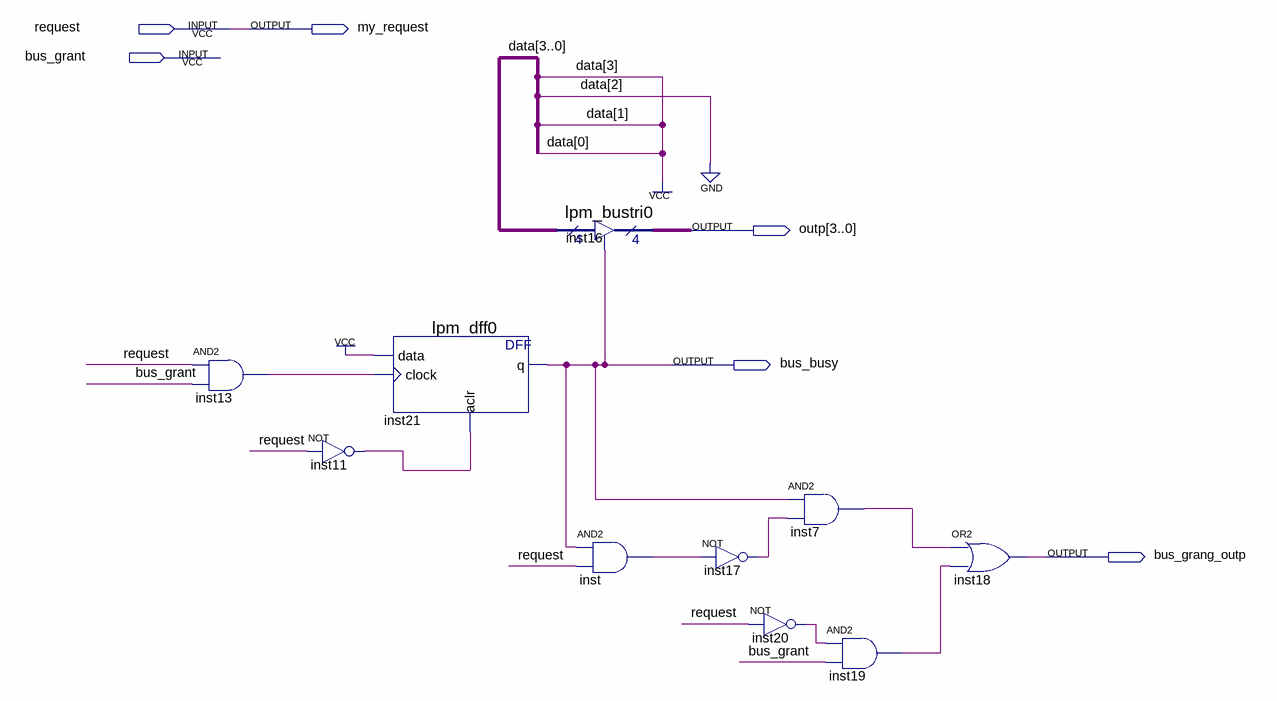
[diagram p0: schematic sheet]
// Quartus schematic device2.bdf as structural Verilog: 10 symbols, 6 pins
module device2 (
  input  request,
  input  bus_grant,
  output my_request,
  output [3:0] outp,
  output bus_busy,
  output bus_grang_outp
);

  wire inst7_out, inst11_out, inst13_out, inst17_out, inst19_out, inst20_out, inst_out;

  and inst13 (inst13_out, request, bus_grant);
  not inst11 (inst11_out, request);
  lpm_dff0 inst21 (.data(1'b1), .clock(inst13_out), .aclr(inst11_out), .q(bus_busy));
  lpm_bustri0 inst16 (.enabledt(bus_busy), .data(4'b1011), .tridata(outp));
  and inst (inst_out, bus_busy, request);
  not inst17 (inst17_out, inst_out);
  and inst7 (inst7_out, bus_busy, inst17_out);
  not inst20 (inst20_out, request);
  and inst19 (inst19_out, inst20_out, bus_grant);
  or inst18 (bus_grang_outp, inst7_out, inst19_out);

  assign my_request = request;
endmodule
